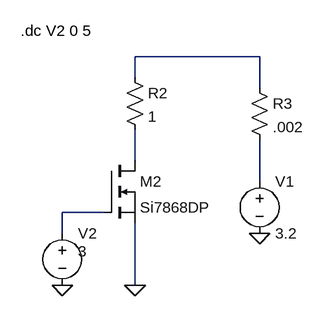
[diagram p0: schematic mosfetDcSweep.asc]
mosfetDcSweep.asc, the LTspice schematic file:
Version 4
SHEET 1 880 680
WIRE 336 -48 144 -48
WIRE 144 -16 144 -48
WIRE 336 0 336 -48
WIRE 144 112 144 64
WIRE 336 144 336 80
WIRE 96 192 32 192
WIRE 32 224 32 192
WIRE 144 304 144 208
FLAG 336 224 0
FLAG 144 304 0
FLAG 32 304 0
SYMBOL voltage 336 128 R0
WINDOW 123 0 0 Left 0
WINDOW 39 0 0 Left 0
SYMATTR InstName V1
SYMATTR Value 3.2
SYMBOL nmos 96 112 R0
SYMATTR InstName M2
SYMATTR Value Si7868DP
SYMBOL res 128 -32 R0
SYMATTR InstName R2
SYMATTR Value 1
SYMBOL res 320 -16 R0
SYMATTR InstName R3
SYMATTR Value .002
SYMBOL voltage 32 208 R0
WINDOW 3 24 44 Left 2
WINDOW 123 0 0 Left 0
WINDOW 39 0 0 Left 0
SYMATTR Value 3
SYMATTR InstName V2
TEXT -32 -88 Left 2 !.dc V2 0 5

The netlist it stands for:
* mosfetDcSweep.asc
V1 N003 0 3.2
M2 N002 N004 0 0 Si7868DP
R2 N001 N002 1
R3 N001 N003 .002
V2 N004 0 3
.model NMOS NMOS
.model PMOS PMOS
.lib standard.mos
.dc V2 0 5
.backanno
.end